# Altium schematic sheet 05-MODEM.SchDoc
size B
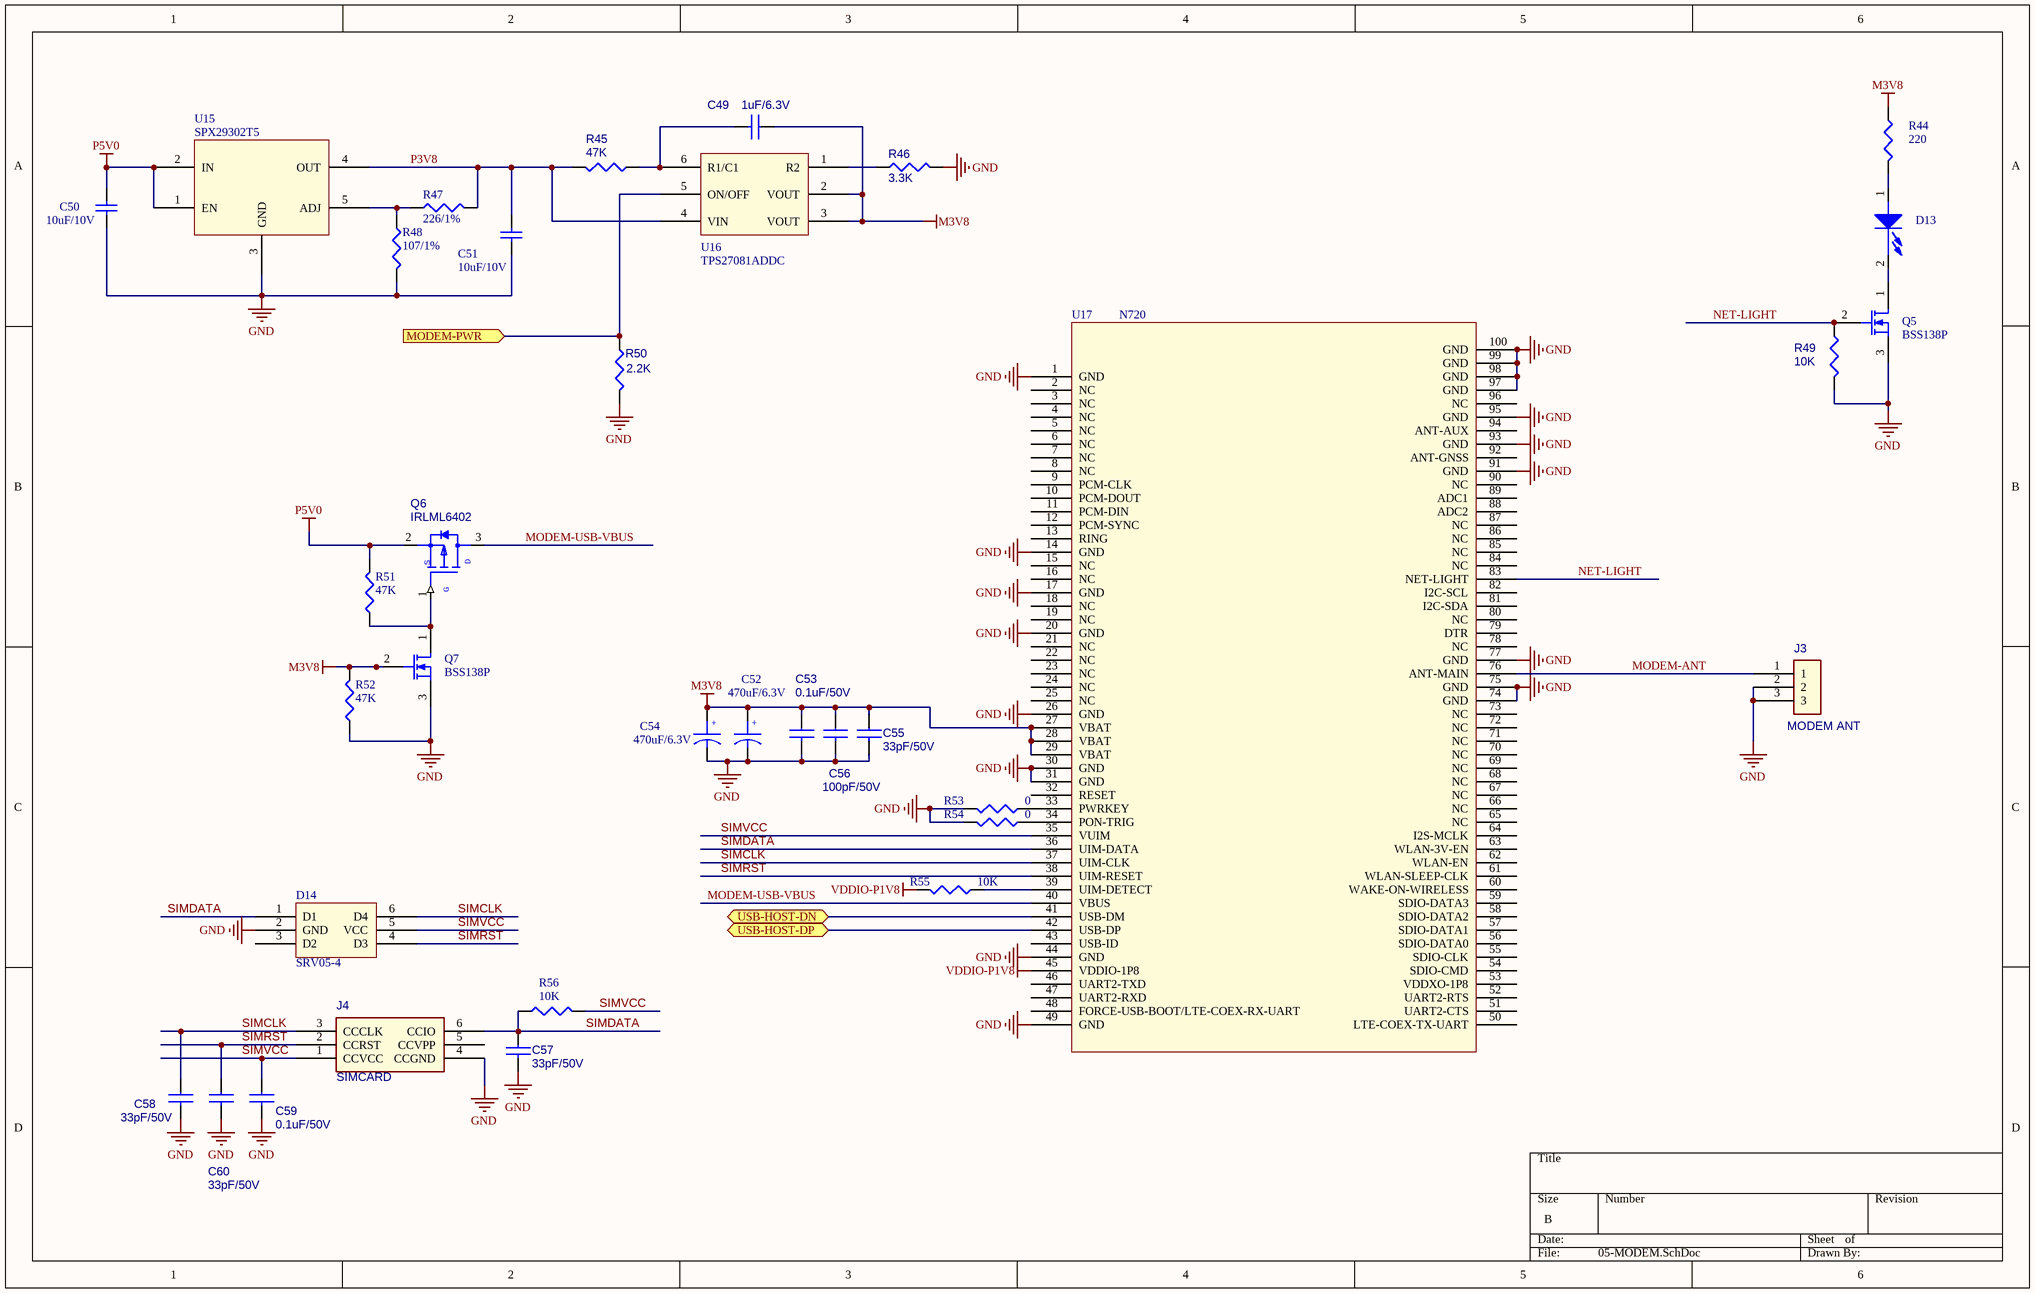
[diagram p0: 05-MODEM.SchDoc]

## Parts
C49  1uF/6.3V  [0402]
C50  10uF/10V  [0805]
C51  10uF/10V  [0805]
C52  470uF/6.3V  [DL-8*10.5]
C53  0.1uF/50V  [0402]
C54  470uF/6.3V  [DL-8*10.5]
C55  33pF/50V  [0402]
C56  100pF/50V  [0402]
C57  33pF/50V  [0402]
C58  33pF/50V  [0402]
C59  0.1uF/50V  [0402]
C60  33pF/50V  [0402]
D13  LED GREEN  [LED-3MM]  (value not drawn)
D14  SRV05-4  [SOT23-6]
J3  MODEM ANT  [ANT]
J4  SIMCARD  [SIM_CARD1]
Q5  BSS138P  [NPN]
Q6  IRLML6402  [MOSFET]
Q7  BSS138P  [NPN]
R44  220  [0402]
R45  47K  [0402]
R46  3.3K  [0402]
R47  226/1%  [0402]
R48  107/1%  [0402]
R49  10K  [0402]
R50  2.2K  [0402]
R51  47K  [0402]
R52  47K  [0402]
R53  0  [0402]
R54  0  [0402]
R55  10K  [0402]
R56  10K  [0402]
U15  SPX29302T5  [TO-263]
U16  TPS27081ADDC  [SOT23-6]
U17  N720  [N720]

## Ports
MODEM-PWR (in), USB-HOST-DN (bidir), USB-HOST-DP (bidir)

## Nets
GND: C50.1 C51.1 C52.2 C53.2 C54.2 C55.2 C56.2 C57.2 C58.2 C59.2 C60.2 D14.2(GND) J3.2 J3.3 J4.4(CCGND) Q5.3(S) Q7.3(S) R46.1 R48.2 R49.1 R50.1 R52.1 R53.2 R54.2 U15.3(GND) U17.1(GND) U17.14(GND) U17.17(GND) U17.20(GND) U17.26(GND) U17.30(GND) U17.31(GND) U17.44(GND) U17.49(GND) U17.74(GND) U17.75(GND) U17.77(GND) U17.91(GND) U17.93(GND) U17.95(GND) U17.97(GND) U17.98(GND) U17.99(GND) U17.100(GND)
M3V8: C49.1 C52.1 C53.1 C54.1 C55.1 C56.1 Q7.2(G) R44.1 R52.2 U16.2(VOUT) U16.3(VOUT) U17.27(VBAT) U17.28(VBAT) U17.29(VBAT)
P5V0: C50.2 Q6.2(S) R51.2 U15.1(EN) U15.2(IN)
VDDIO-P1V8: R55.2 U17.45(VDDIO-1P8)
MODEM-ANT: J3.1 U17.76(ANT-MAIN)
MODEM-PWR: R50.2 U16.5(ON/OFF) ; port MODEM-PWR
MODEM-USB-VBUS: Q6.3(D) U17.40(VBUS)
NET-LIGHT: Q5.2(G) R49.2 U17.83(NET-LIGHT)
P3V8: C51.2 R45.1 R47.2 U15.4(OUT) U16.4(VIN)
SIMCLK: C58.1 D14.6(D4) J4.3(CCCLK) U17.37(UIM-CLK)
SIMDATA: C57.1 D14.1(D1) J4.6(CCIO) R56.1 U17.36(UIM-DATA)
SIMRST: C60.1 D14.4(D3) J4.2(CCRST) U17.38(UIM-RESET)
SIMVCC: C59.1 D14.5(VCC) J4.1(CCVCC) R56.2 U17.35(VUIM)
USB-HOST-DN: U17.41(USB-DM) ; port USB-HOST-DN
USB-HOST-DP: U17.42(USB-DP) ; port USB-HOST-DP
NetC49_2: C49.2 R45.2 U16.6(R1/C1)
NetD13_1: D13.1(ANODE) R44.2
NetD13_2: D13.2(CATHODE) Q5.1(D)
NetQ6_1: Q6.1(G) Q7.1(D) R51.1
NetR46_2: R46.2 U16.1(R2)
NetR47_1: R47.1 R48.1 U15.5(ADJ)
NetR53_1: R53.1 U17.33(PWRKEY)
NetR54_1: R54.1 U17.34(PON-TRIG)
NetR55_1: R55.1 U17.39(UIM-DETECT)

Not connected (* = marked no-connect by the designer): D14 3(D2); J4 5(CCVPP); U17 2(NC) 3(NC) 4(NC) 5(NC) 6(NC) 7(NC) 8(NC) 9(PCM-CLK) 10(PCM-DOUT) 11(PCM-DIN) 12(PCM-SYNC) 13(RING) 15(NC) 16(NC) 18(NC) 19(NC) 21(NC) 22(NC) 23(NC) 24(NC) 25(NC) 32(RESET) 43(USB-ID) 46(UART2-TXD) 47(UART2-RXD) 48(FORCE-USB-BOOT/LTE-COEX-RX-UART) 50(LTE-COEX-TX-UART) 51(UART2-CTS) 52(UART2-RTS) 53(VDDXO-1P8) 54(SDIO-CMD) 55(SDIO-CLK) 56(SDIO-DATA0) 57(SDIO-DATA1) 58(SDIO-DATA2) 59(SDIO-DATA3) 60(WAKE-ON-WIRELESS) 61(WLAN-SLEEP-CLK) 62(WLAN-EN) 63(WLAN-3V-EN) 64(I2S-MCLK) 65(NC) 66(NC) 67(NC) 68(NC) 69(NC) 70(NC) 71(NC) 72(NC) 73(NC) 78(NC) 79(DTR) 80(NC) 81(I2C-SDA) 82(I2C-SCL) 84(NC) 85(NC) 86(NC) 87(NC) 88(ADC2) 89(ADC1) 90(NC) 92(ANT-GNSS) 94(ANT-AUX) 96(NC)

## Notes on the sheet
- (in symbol CAP WP) +

## Library data of the parts
C49 C53 C55-C60 = P_CAP NP
C50 C51 = Cap: Capacitor; Value: 0.1uF; Published: 8-Jun-2000; LatestRevisionDate: 17-Jul-2002; LatestRevisionNote: Re-released for DXP Platform.; PackageReference: RAD-0.3; Publisher: Altium Limited; PackageDescription: Radial Cap, Thru-Hole; 2 Leads; 0.3 in Pin Spacing
C52 C54 = CAP WP
D13 = LN01401_1
J3 = HRS_U_0.FL-R-SMT-10
Q5 Q7 = MOSFET-N: N-Channel MOSFET; Published: 8-Jun-2000; LatestRevisionDate: 17-Jul-2002; LatestRevisionNote: Re-released for DXP Platform.; PackageVersion: 1995/1996; PackageReference: E3; Publisher: Altium Limited; PackageDescription: TO, Flat Index; 3 In-Line, Axial Leads; Body Dia. 4.6mm; Lead Dia. 0.5 mm (max)
Q6 = AO3401L_SOT23-3_0: Part Number: SB934010010; ROOM: USB POWER; Part Value: AO3401L_SOT23-3
R44 R51 R52 = CR16-1003FM
R45 R46 R49 R50 = P_R
R47 R48 R53-R56 = Res3: Resistor; Value: 1K; Published: 8-Jun-2000; LatestRevisionDate: 29-May-2009; LatestRevisionNote: IPC-7351 Footprint Added.; PackageReference: J1-0603; Publisher: Altium Limited; PackageDescription: Chip Resistor
U15 = MIC29302AWU
U16 = TPS27081A